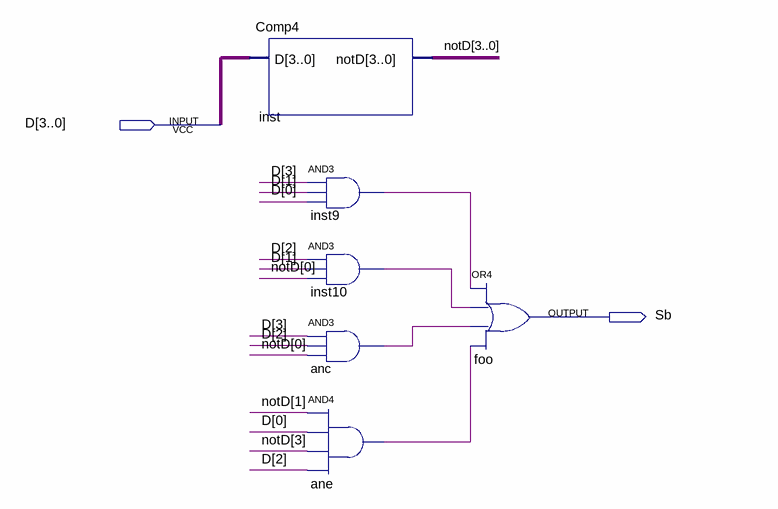
[diagram p0: schematic sheet]
// Quartus schematic Sb.bdf as structural Verilog: 6 symbols, 2 pins
module Sb (
  input  [3:0] D,
  output Sb
);

  wire anc_out, ane_out, inst9_out, inst10_out;
  wire [3:0] notD;

  Comp4 inst (.D(D), .notD(notD));
  and inst9 (inst9_out, D[3], D[1], D[0]);
  and inst10 (inst10_out, D[2], D[1], notD[0]);
  and anc (anc_out, D[3], D[2], notD[0]);
  and ane (ane_out, notD[1], D[0], notD[3], D[2]);
  or foo (Sb, inst9_out, inst10_out, anc_out, ane_out);
endmodule
